# EAGLE design ttgo-diy (EAGLE 7.6.0)
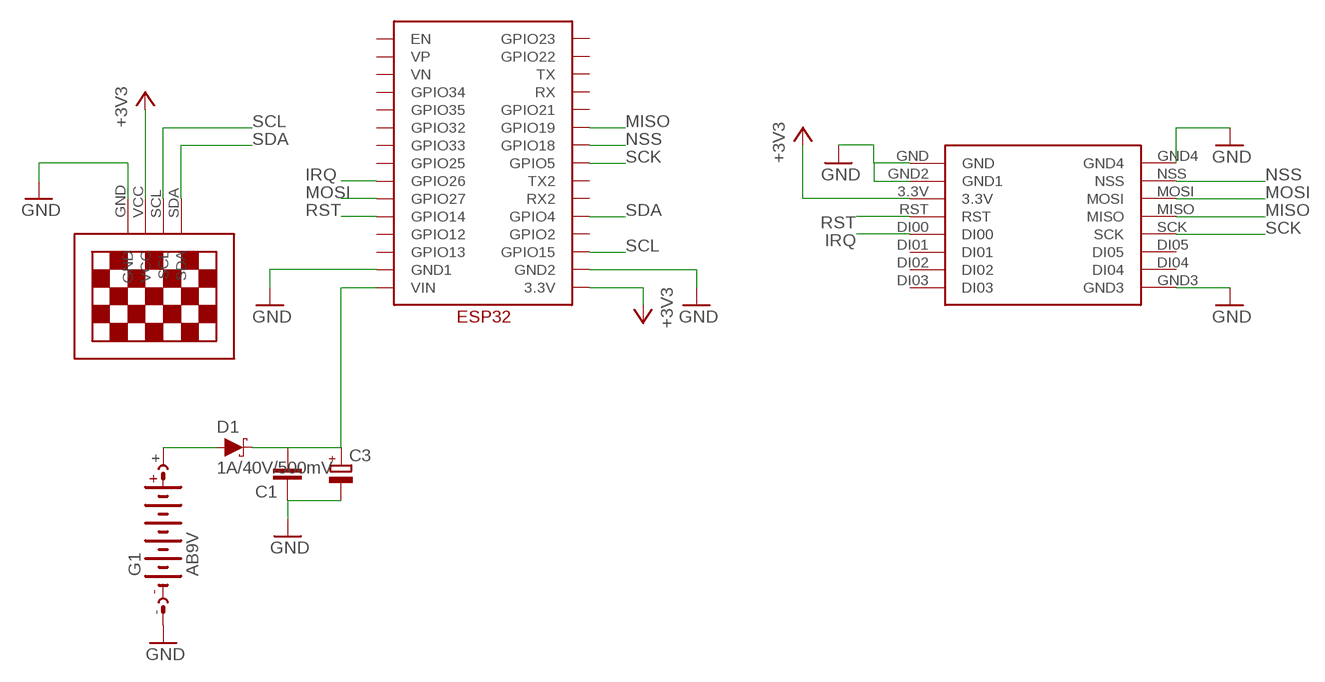
[diagram p0: schematic, sheet 1]

## Parts
C1  C-EUC1206  [C1206]
C3  CPOL-EUCT6032  [CT6032]
D1  1A/40V/500mV  DIODE-SCHOTTKY-SS14  [SMA-DIODE]
G1  AB9V  [AB9V]
U$1  LORA-02DIL  [DIL8X11]
U$2  ESP32  [ESP32]
U$3  13"OLED13"OLED  [1.3"OLED]

## Nets
+3V3: U$1.3.3V U$2.3.3V U$3.VCC
GND: C1.1 C3.- G1.- U$1.GND U$1.GND2(GND1) U$1.GND3 U$1.GND4 U$2.GND1 U$2.GND2 U$3.GND
IRQ: U$1.DI00 U$2.GPIO26
MISO: U$1.MISO U$2.GPIO19
MOSI: U$1.MOSI U$2.GPIO27
N$1: C1.2 C3.+ D1.C U$2.VIN
N$3: D1.A G1.+
NSS: U$1.NSS U$2.GPIO18
RST: U$1.RST U$2.GPIO14
SCK: U$1.SCK U$2.GPIO5
SCL: U$2.GPIO15 U$3.SCL
SDA: U$2.GPIO4 U$3.SDA
Unconnected: U$1.DI01 U$1.DI02 U$1.DI03 U$1.DI04 U$1.DI05 U$2.EN U$2.GPIO2 U$2.GPIO12 U$2.GPIO13 U$2.GPIO21 U$2.GPIO22 U$2.GPIO23 U$2.GPIO25 U$2.GPIO32 U$2.GPIO33 U$2.GPIO34 U$2.GPIO35 U$2.RX U$2.RX2 U$2.TX U$2.TX2 U$2.VN U$2.VP

## Library data of the parts
C1 = rcl:C-EU: CAPACITOR, European symbol
C3 = rcl:CPOL-EU: POLARIZED CAPACITOR, European symbol
D1 = SparkFun-DiscreteSemi:DIODE-SCHOTTKY: Schottky diode A Schottky diode is a semiconductor diode which has a low forward voltage drop and a very fast switching action.; PROD_ID: DIO-08053
G1 = battery:AB9V: 9-V BATTERY CLIP
U$1 = LORA-02:LORA-02: MODULO LORA-02
U$2 = ESP32:ESP32
U$3 = Oled-13:13"OLED

## Board
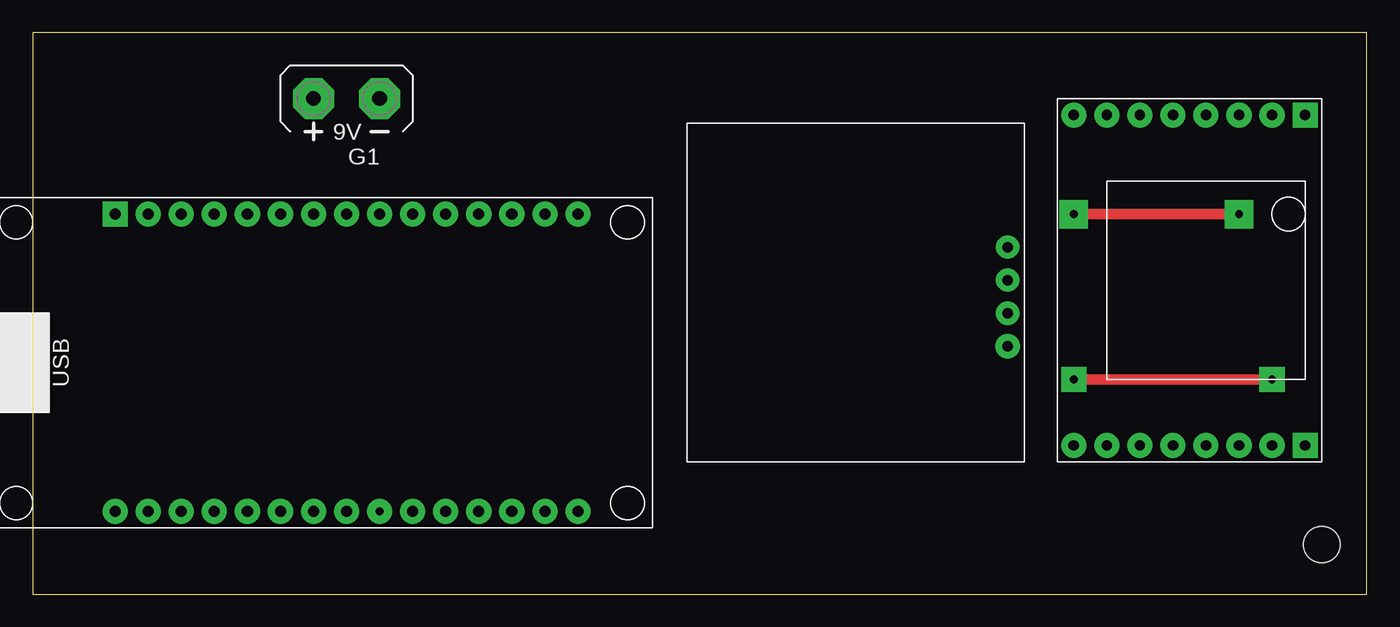
[diagram p1: board, top side]
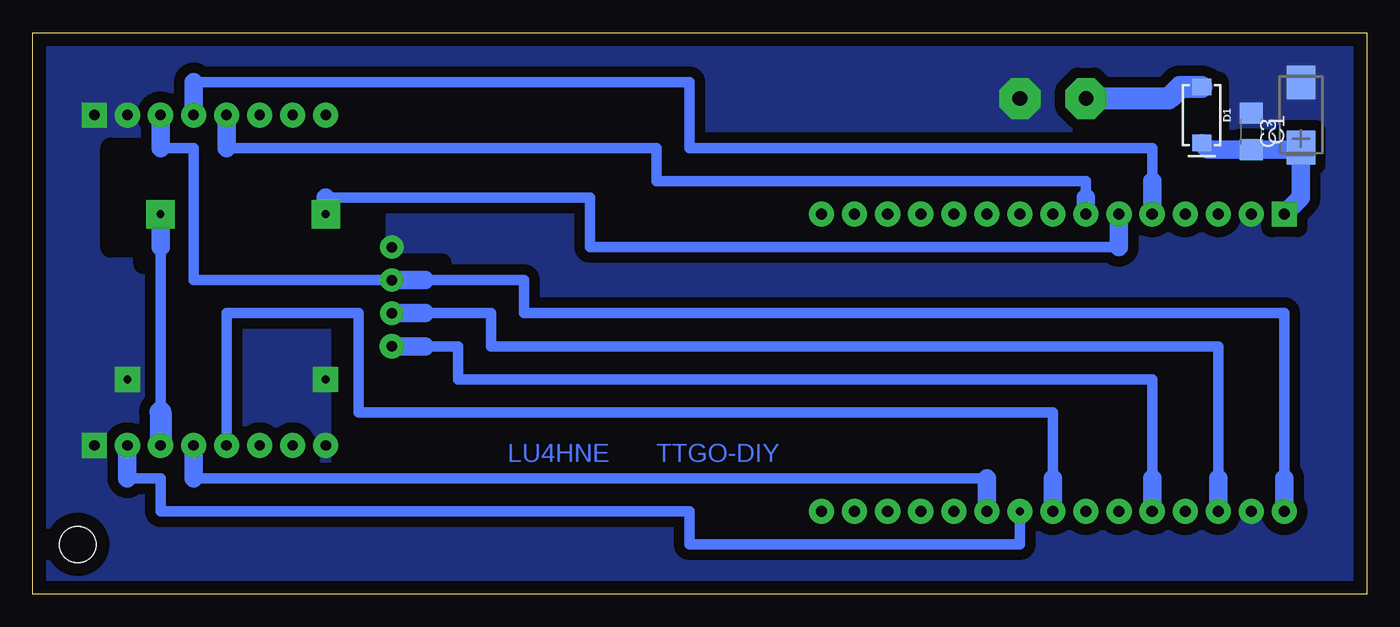
[diagram p2: board, bottom side, seen from below]

Size 102.54 x 43.17 mm. Coordinates in mm from the lower left corner, seen from the top.
Outline: 0,0 102.54,0 102.54,43.17 0,43.17 0,0
Copper layers (1*16): Top 0.035mm / dielectric 1.5mm / Bottom 0.035mm
Design rules "default": minimum track width 10mil, minimum drill 24mil, track to track 8mil, track to pad 8mil, pad to pad 8mil, via to via 8mil, smd to smd 8mil, copper to edge 40mil, drill to drill 8mil, minimum pad ring 10mil, minimum via ring 8mil, stop-mask expansion 4mil, vias tented up to drill 0mil, thermal gap 10mil
Holes 2.8 mm at 99.06,3.81
bRestrict: area 71.1,7.6 to 78.7,25.4; area 6.3,7.6 to 11.4,17.8; area 11.4,34.3 to 14,39.4; area 6.3,30.5 to 16.5,33; area 81.3,6.3 to 91.4,11.4; area 78.7,26.7 to 96.5,34.3; area 76.2,25.4 to 94,33

### Footprints (pad centres in the part's own frame; a part is rotated, then mirrored left to right if it is on the bottom)
C1206 = smd 1.6 x 1.8: 1 -1.4,0; 2 1.4,0
CT6032 = smd 2.6 x 2.2: + -2.5,0; - 2.5,0
SMA-DIODE = smd 1.27 x 1.47: A -2.15,0; C 2.15,0
AB9V = drill 1.118 pad 3.15 octagon: + 0,2.54; - 0,-2.54
DIL8X11 = drill 0.8 pad 1.93: 3.3V 0,-5.08; DI00 0,-10.16; DI01 0,-12.7; DI02 0,-15.24; DI03 0,-17.78; DI04 25.4,-15.24; DI05 25.4,-12.7; GND2 0,-2.54; GND3 25.4,-17.78; MISO 25.4,-7.62; MOSI 25.4,-5.08; NSS 25.4,-2.54; RST 0,-7.62; SCK 25.4,-10.16 | drill 0.8 pad 1.93 square: GND 0,0; GND4 25.4,0
ESP32 = drill 0.85 pad 1.93: 3.3V 22.86,0; EN 0,35.56; GND1 0,2.54; GND2 22.86,2.54; GPIO2 22.86,7.62; GPIO4 22.86,10.16; GPIO5 22.86,17.78; GPIO12 0,7.62; GPIO13 0,5.08; GPIO14 0,10.16; GPIO15 22.86,5.08; GPIO19 22.86,22.86; GPIO21 22.86,25.4; GPIO22 22.86,33.02; GPIO23 22.86,35.56; GPIO25 0,17.78; GPIO26 0,15.24; GPIO27 0,12.7; GPIO32 0,22.86; GPIO33 0,20.32; GPIO34 0,27.94; GPIO35 0,25.4; RX 22.86,27.94; RX2 22.86,12.7; TX 22.86,30.48; TX2 22.86,15.24; VN 0,30.48; VP 0,33.02 | drill 0.6 pad 1.93: GPIO18 22.86,20.32 | drill 0.85 pad 1.93 square: VIN 0,0
1.3"OLED = drill 0.8 pad 1.778: GND 0,0; SCL 5.08,0; VCC 2.54,0 | drill 0.8 pad 1.9: SDA 7.62,0

### Placement (x,y rotation side)
C1  8.89,35.56 270 bottom
C3  5.08,36.83 90 bottom
D1  12.7,36.83 270 bottom
G1  24.13,38.1 90 top
U$1  97.79,36.83 270 top
U$2  6.35,29.21 270 top
U$3  74.93,26.67 270 top

### Tracks (layer width: path | path; a pad name or v marks a point on that pad's centre or on a via)
+3V3
  Bottom 0.813: 6.35,8.89 6.35,21.59 64.77,21.59 64.77,24.13 72.39,24.13 | U$3.VCC 90.17,24.13 90.17,34.29 92.71,34.29
  Bottom 1.422: U$2.3.3V 6.35,8.89 | 92.71,34.29 U$1.3.3V | U$3.VCC 72.39,24.13
GND  (via drill 0.6 pad 1.93)
  Top 0.813: v80.01,16.51 v95.25,16.51
  pour Bottom (isolate 0.813, no thermals): -1.27,46.99 105.41,46.99 105.41,-3.81 -1.27,-3.81
IRQ
  Bottom 0.813: 87.63,34.29 54.61,34.29 54.61,31.75 21.59,31.75 21.59,30.48
  Bottom 1.422: 87.63,34.29 U$1.DI00 | 21.59,30.48 U$2.GPIO26
MISO
  Bottom 0.813: 90.17,8.89 29.21,8.89
  Bottom 1.422: U$1.MISO 90.17,8.89 | U$2.GPIO19 29.21,8.89
MOSI  (via drill 0.6 pad 2.18)
  Top 0.813: v80.01,29.21 v92.71,29.21
  Bottom 0.813: 19.05,26.67 59.69,26.67 59.69,30.48 80.01,30.48 | 92.71,26.67 92.71,13.97
  Bottom 1.422: v92.71,29.21 92.71,26.67 | 80.01,30.48 v80.01,29.21 | 19.05,26.67 U$2.GPIO27
  Bottom 1.676: 92.71,13.97 U$1.MOSI
N$1
  Bottom 1.016: 5.08,34.16 C3.+
  Bottom 1.422: U$2.VIN 5.08,30.48 5.08,34.16 C1.2 12.18,34.16 D1.C
N$3
  Bottom 1.676: G1.+ 15.24,38.1 14.36,38.98 D1.A
NSS
  Bottom 0.813: 95.25,8.89 92.71,8.89 92.71,6.35 52.07,6.35 52.07,3.81 26.67,3.81 U$2.GPIO18
  Bottom 1.422: 95.25,8.89 U$1.NSS
RST
  Bottom 0.813: 90.17,39.37 52.07,39.37 52.07,34.29 16.51,34.29 16.51,31.75
  Bottom 1.422: U$1.RST 90.17,39.37 | 16.51,31.75 U$2.GPIO14
SCK
  Bottom 0.813: 24.13,8.89 24.13,13.97 77.47,13.97 77.47,21.59 87.63,21.59 U$1.SCK
  Bottom 1.422: U$2.GPIO5 24.13,8.89
SCL
  Bottom 0.813: 11.43,8.89 11.43,19.05 67.31,19.05 67.31,21.59 72.39,21.59
  Bottom 1.422: 11.43,8.89 U$2.GPIO15 | U$3.SCL 72.39,21.59
SDA
  Bottom 0.813: 16.51,8.89 16.51,16.51 69.85,16.51 69.85,19.05 72.39,19.05
  Bottom 1.422: 16.51,8.89 U$2.GPIO4 | U$3.SDA 72.39,19.05

### Text on the board
Bottom: TTGO-DIY | LU4HNE